# EAGLE design BGA-4_Breakout (EAGLE 9.6.2)
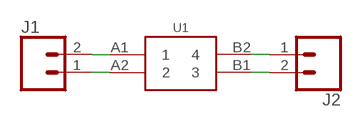
[diagram p0: schematic, sheet 1]

## Parts
J1  CONN_02  [1X02]
J2  CONN_02  [1X02]
U1  GEN_4BGA  [YFP0004]

## Nets
N$1: J2.1 U1.B2
N$2: J2.2 U1.B1
N$3: J1.1 U1.A2
N$4: J1.2 U1.A1

## Library data of the parts
J1 J2 = bschulz:CONN_02: Genaric 2 terminal header SCREW_2.54 <https://www.digikey.com/product-detail/en/on-shore-technology-inc/OSTVN02A150/ED10561-ND/1588862> 39532_RA <https://www.digikey.com/product-detail/en/molex/0395321002/WM7845-ND/1280696>
U1 = bschulz:GEN_4: Generic 4 Pin Package for Breakout Boards

## Board
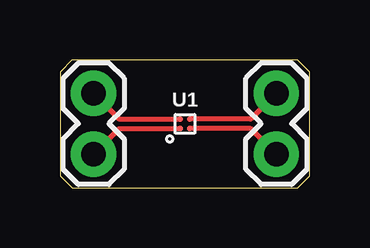
[diagram p1: board, top side]

Size 10.41 x 5.33 mm. Coordinates in mm from the lower left corner, seen from the top.
Outline: 0,4.82 0,0.5 0.5,0 9.91,0 10.41,0.5 10.41,4.83 9.91,5.33 0.5,5.32 0,4.82
Copper layers (1*16): Top 0.035559375mm / dielectric 1.6mm / Bottom 0.035559375mm
Design rules "oshpark-2layer": minimum track width 6mil, minimum drill 10mil, track to track 6mil, track to pad 6mil, pad to pad 6mil, via to via 6mil, smd to smd 6mil, copper to edge 15mil, drill to drill 6mil, minimum pad ring 5mil, minimum via ring 5mil, stop-mask expansion 2.5mil, vias tented up to drill 0mil, thermal gap 10mil

### Footprints (pad centres in the part's own frame; a part is rotated, then mirrored left to right if it is on the bottom)
1X02 = drill 1.016 pad 1.88: 1 0,0; 2 2.54,0
YFP0004 = smd 0.23 x 0.23: A1 -0.2,0.2; A2 0.2,0.2; B1 -0.2,-0.2; B2 0.2,-0.2

### Placement (x,y rotation side)
J1  1.4,3.94 270 top
J2  9.02,3.94 270 top
U1  5.21,2.66 90 top

### Tracks (layer width: path | path; a pad name or v marks a point on that pad's centre or on a via)
N$1
  Top 0.2: J2.1 7.94,2.86 U1.B2
N$2
  Top 0.2: J2.2 7.95,2.46 U1.B1
N$3
  Top 0.2: J1.1 2.47,2.86 U1.A2
N$4
  Top 0.2: J1.2 2.46,2.46 U1.A1

### Text on the board
tDocu: BGA-4 | A2 | B2 | A1 | B1
bDocu: B. Schulz / Break44